# EAGLE design Mini_PLC_USB (EAGLE 9.6.2)

## Sheet 1 of 3
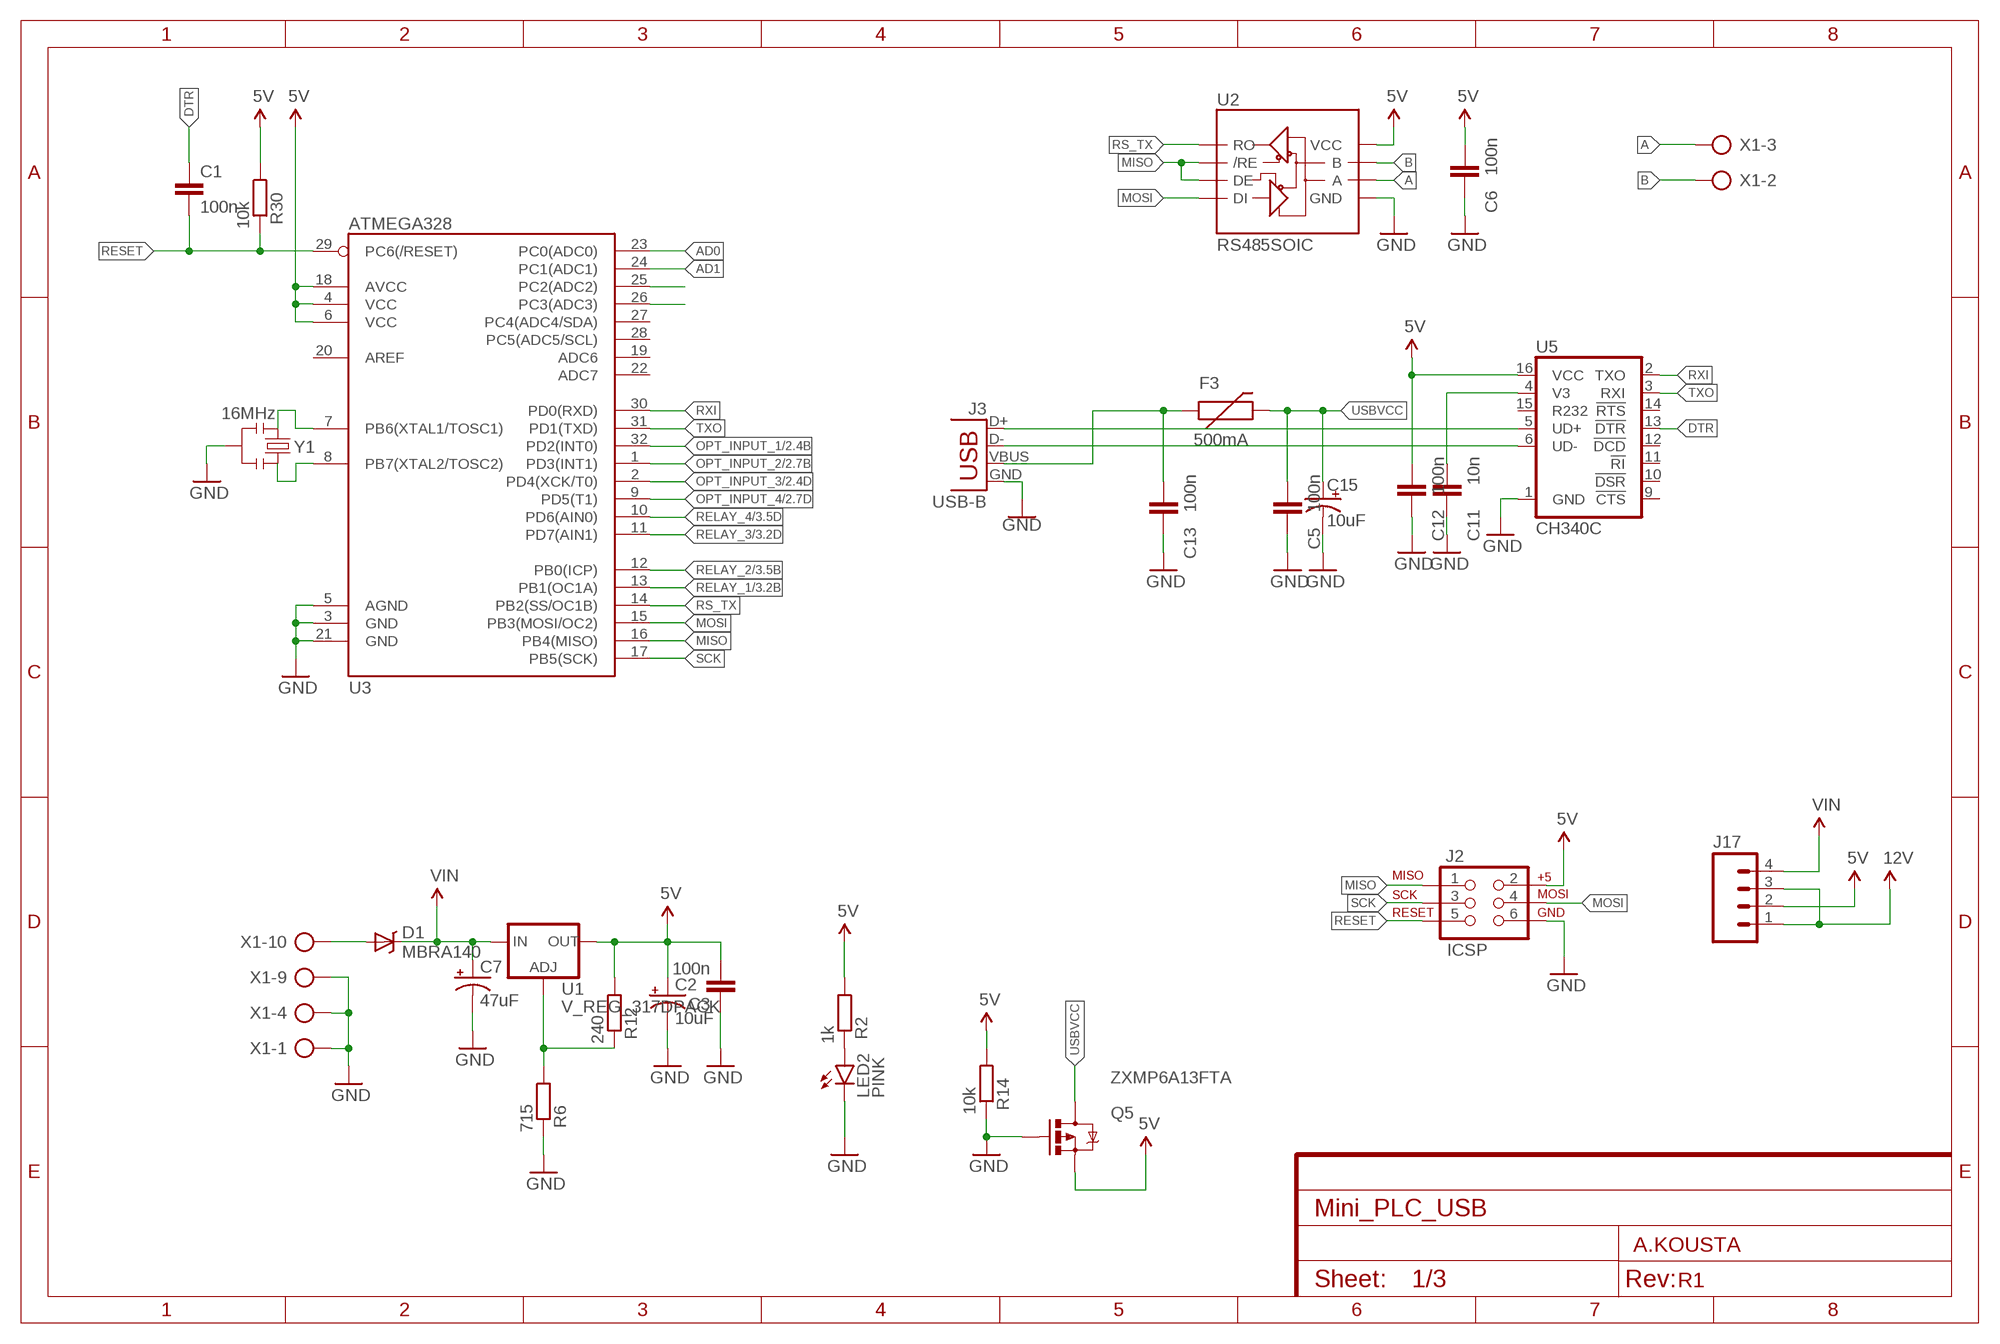
[diagram p0: schematic, sheet 1]

### Parts
C1  100n  C-EUC1206  [C1206]
C2  10uF  CAP_POL1206  [EIA3216]
C3  100n  C-EUC1206  [C1206]
C5  100n  C-EUC1206  [C1206]
C6  100n  C-EUC1206  [C1206]
C7  47uF  CAP_POLD  [PANASONIC_D]
C11  10n  C-EUC1206  [C1206]
C12  100n  C-EUC1206  [C1206]
C13  100n  C-EUC1206  [C1206]
C15  10uF  10UF-POLAR-EIA3216-16V-10%(TANT)  [EIA3216]
D1  MBRA140  DIODE-SCHOTTKY_  [SMA-DIODE]
F3  500mA  PTCSMD  [PTC-1206]
J2  ICSP  AVR_SPI_PRG_6PTH  [2X3]
J3  USB-B  USBPTH  [USB-B-PTH]
J17  M04PTH  [1X04]
LED2  PINK  LED-PINK1206  [LED-1206@1]
Q5  ZXMP6A13FTA  MOSFET-PCHANNELSMD  [SOT23-3]
R2  1k  R-EU_M1206  [M1206]
R6  715  R-EU_M1206  [M1206]
R12  240  R-EU_M1206  [M1206]
R14  10k  R-EU_M1206  [M1206]
R30  10k  R-EU_M1206  [M1206]
U1  V_REG_317DPACK  [V-REG_DPACK]
U2  RS485SOIC  [SO08]
U3  ATMEGA328  ATMEGA168  [TQFP32-08]
U5  CH340C  [SO016]
X1  AK500/10-H  [AK500/10-H]
Y1  16MHz  RESONATORSMD  [RESONATOR-SMD]

### Nets
5V: C2.A(+) C3.2 C6.2 C12.2 J2.2 J17.2 Q5.2(S) R2.1 R12.1 R14.1 R30.1 U1.4(OUT) U2.8(VCC) U3.4(VCC) U3.6(VCC) U3.18(AVCC) U5.16(VCC) ; also sheet 2
12V: J17.1 J17.3 ; also sheet 3
A: U2.6(A) X1.3
AD0: U3.23(PC0(ADC0))
AD1: U3.24(PC1(ADC1))
B: U2.7(B) X1.2
D+: J3.D+ U5.5(UD+)
D-: J3.D- U5.6(UD-)
DTR: C1.1 U5.13(!DTR)
GND: C2.C(-) C3.1 C5.1 C6.1 C7.- C11.1 C12.1 C13.1 C15.- J2.6 J3.GND LED2.C Q5.1(G) R6.2 R14.2 U2.5(GND) U3.3(GND) U3.5(AGND) U3.21(GND) U5.1(GND) X1.1 X1.4 X1.9 Y1.2 ; also sheet 2,3
MISO: J2.1 U2.2(/RE) U2.3(DE) U3.16(PB4(MISO))
MOSI: J2.4 U2.4(DI) U3.15(PB3(MOSI/OC2))
N$2: U3.25(PC2(ADC2))
N$3: LED2.A R2.2
N$7: U3.7(PB6(XTAL1/TOSC1)) Y1.1
N$8: R6.1 R12.2 U1.1(ADJ)
N$9: U3.26(PC3(ADC3))
N$12: U3.8(PB7(XTAL2/TOSC2)) Y1.3
N$14: D1.A X1.10
N$32: C11.2 U5.4(V3)
OPT_INPUT_1: U3.32(PD2(INT0)) ; also sheet 2
OPT_INPUT_2: U3.1(PD3(INT1)) ; also sheet 2
OPT_INPUT_3: U3.2(PD4(XCK/T0)) ; also sheet 2
OPT_INPUT_4: U3.9(PD5(T1)) ; also sheet 2
RELAY_1: U3.13(PB1(OC1A)) ; also sheet 3
RELAY_2: U3.12(PB0(ICP)) ; also sheet 3
RELAY_3: U3.11(PD7(AIN1)) ; also sheet 3
RELAY_4: U3.10(PD6(AIN0)) ; also sheet 3
RESET: C1.2 J2.5 R30.2 U3.29(PC6(/RESET))
RS_TX: U2.1(RO) U3.14(PB2(SS/OC1B))
RXI: U3.30(PD0(RXD)) U5.2(TXO)
SCK: J2.3 U3.17(PB5(SCK))
TXO: U3.31(PD1(TXD)) U5.3(RXI)
USBVCC: C5.2 C15.+ F3.2 Q5.3(D)
VIN: C7.+ D1.C J17.4 U1.3(IN) ; also sheet 2
VUSB [power]: C13.2 F3.1 J3.VBUS
Unconnected: U3.19(ADC6) U3.20(AREF) U3.22(ADC7) U3.27(PC4(ADC4/SDA)) U3.28(PC5(ADC5/SCL)) U5.9(!CTS) U5.10(!DSR) U5.11(!RI) U5.12(!DCD) U5.14(!RTS) U5.15(R232)

### Notes on the sheet
- A.KOUSTA
- R1

## Sheet 2 of 3
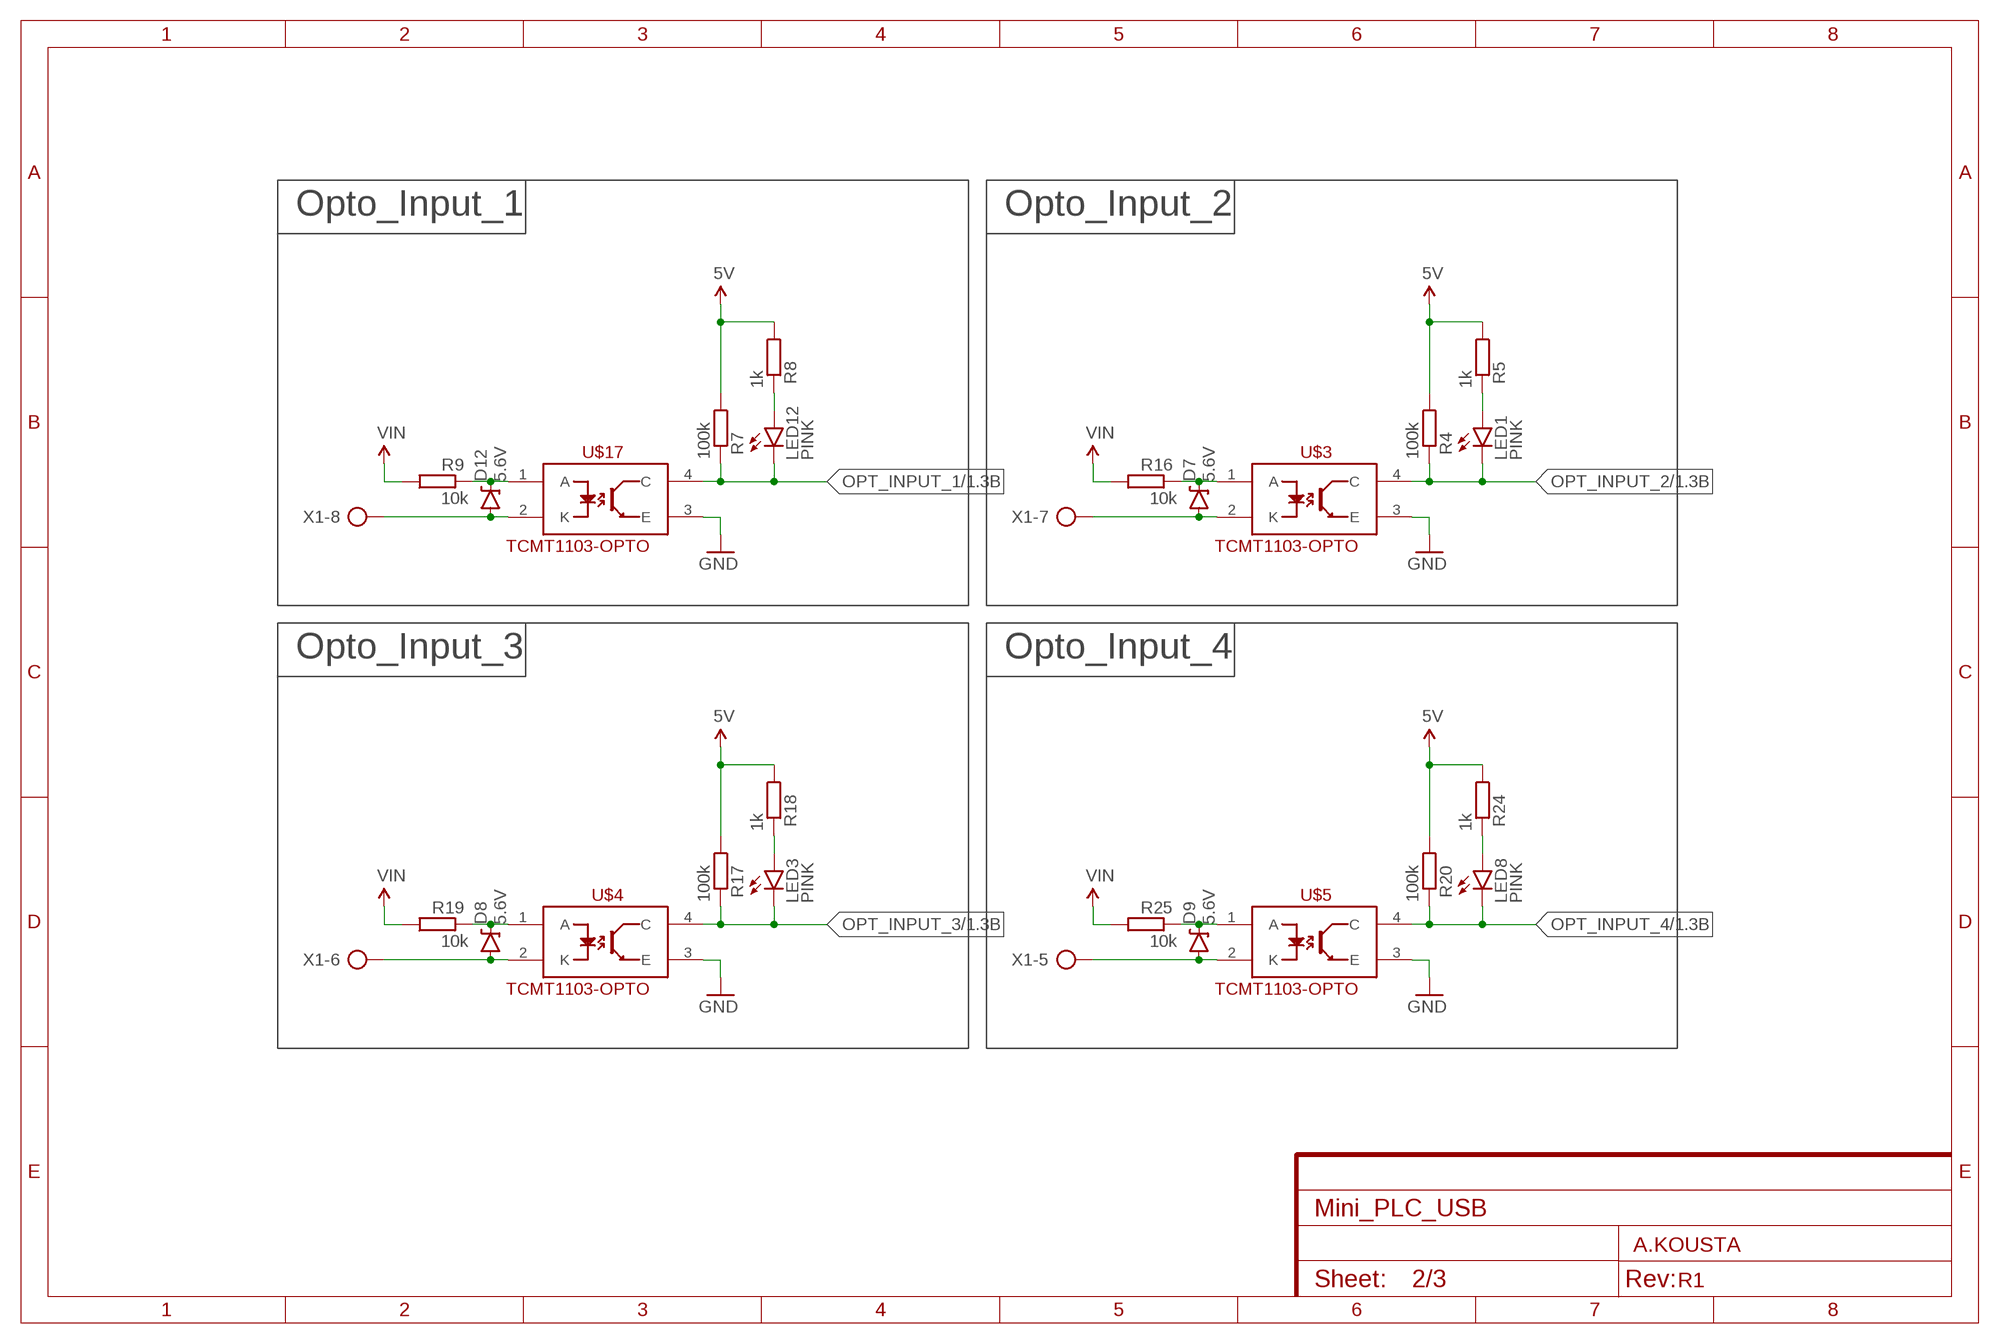
[diagram p1: schematic, sheet 2]

### Parts
D7  5.6V  DIODE-ZENER5.6V  [SOD-323]
D8  5.6V  DIODE-ZENER5.6V  [SOD-323]
D9  5.6V  DIODE-ZENER5.6V  [SOD-323]
D12  5.6V  DIODE-ZENER5.6V  [SOD-323]
LED1  PINK  LED-PINK1206  [LED-1206@1]
LED3  PINK  LED-PINK1206  [LED-1206@1]
LED8  PINK  LED-PINK1206  [LED-1206@1]
LED12  PINK  LED-PINK1206  [LED-1206@1]
R4  100k  R-EU_M1206  [M1206]
R5  1k  R-EU_M1206  [M1206]
R7  100k  R-EU_M1206  [M1206]
R8  1k  R-EU_M1206  [M1206]
R9  10k  R-EU_M1206  [M1206]
R16  10k  R-EU_M1206  [M1206]
R17  100k  R-EU_M1206  [M1206]
R18  1k  R-EU_M1206  [M1206]
R19  10k  R-EU_M1206  [M1206]
R20  100k  R-EU_M1206  [M1206]
R24  1k  R-EU_M1206  [M1206]
R25  10k  R-EU_M1206  [M1206]
U$3  TCMT1103-OPTO  [SSOP-4]
U$4  TCMT1103-OPTO  [SSOP-4]
U$5  TCMT1103-OPTO  [SSOP-4]
U$17  TCMT1103-OPTO  [SSOP-4]

### Nets
5V: R4.1 R5.1 R7.1 R8.1 R17.1 R18.1 R20.1 R24.1 ; also sheet 1
GND: U$3.3(E) U$4.3(E) U$5.3(E) U$17.3(E) ; also sheet 1,3
N$1: D12.A U$17.2(K) X1.8
N$5: D12.C R9.2 U$17.1(A)
N$6: D7.C R16.2 U$3.1(A)
N$13: D7.A U$3.2(K) X1.7
N$17: LED1.A R5.2
N$19: D8.C R19.2 U$4.1(A)
N$20: D8.A U$4.2(K) X1.6
N$23: LED3.A R18.2
N$26: D9.C R25.2 U$5.1(A)
N$27: D9.A U$5.2(K) X1.5
N$31: LED8.A R24.2
N$33: LED12.A R8.2
OPT_INPUT_1: LED12.C R7.2 U$17.4(C) ; also sheet 1
OPT_INPUT_2: LED1.C R4.2 U$3.4(C) ; also sheet 1
OPT_INPUT_3: LED3.C R17.2 U$4.4(C) ; also sheet 1
OPT_INPUT_4: LED8.C R20.2 U$5.4(C) ; also sheet 1
VIN: R9.1 R16.1 R19.1 R25.1 ; also sheet 1

### Notes on the sheet
- Opto_Input_1 | Opto_Input_2
- Opto_Input_3 | Opto_Input_4
- A.KOUSTA
- R1

## Sheet 3 of 3
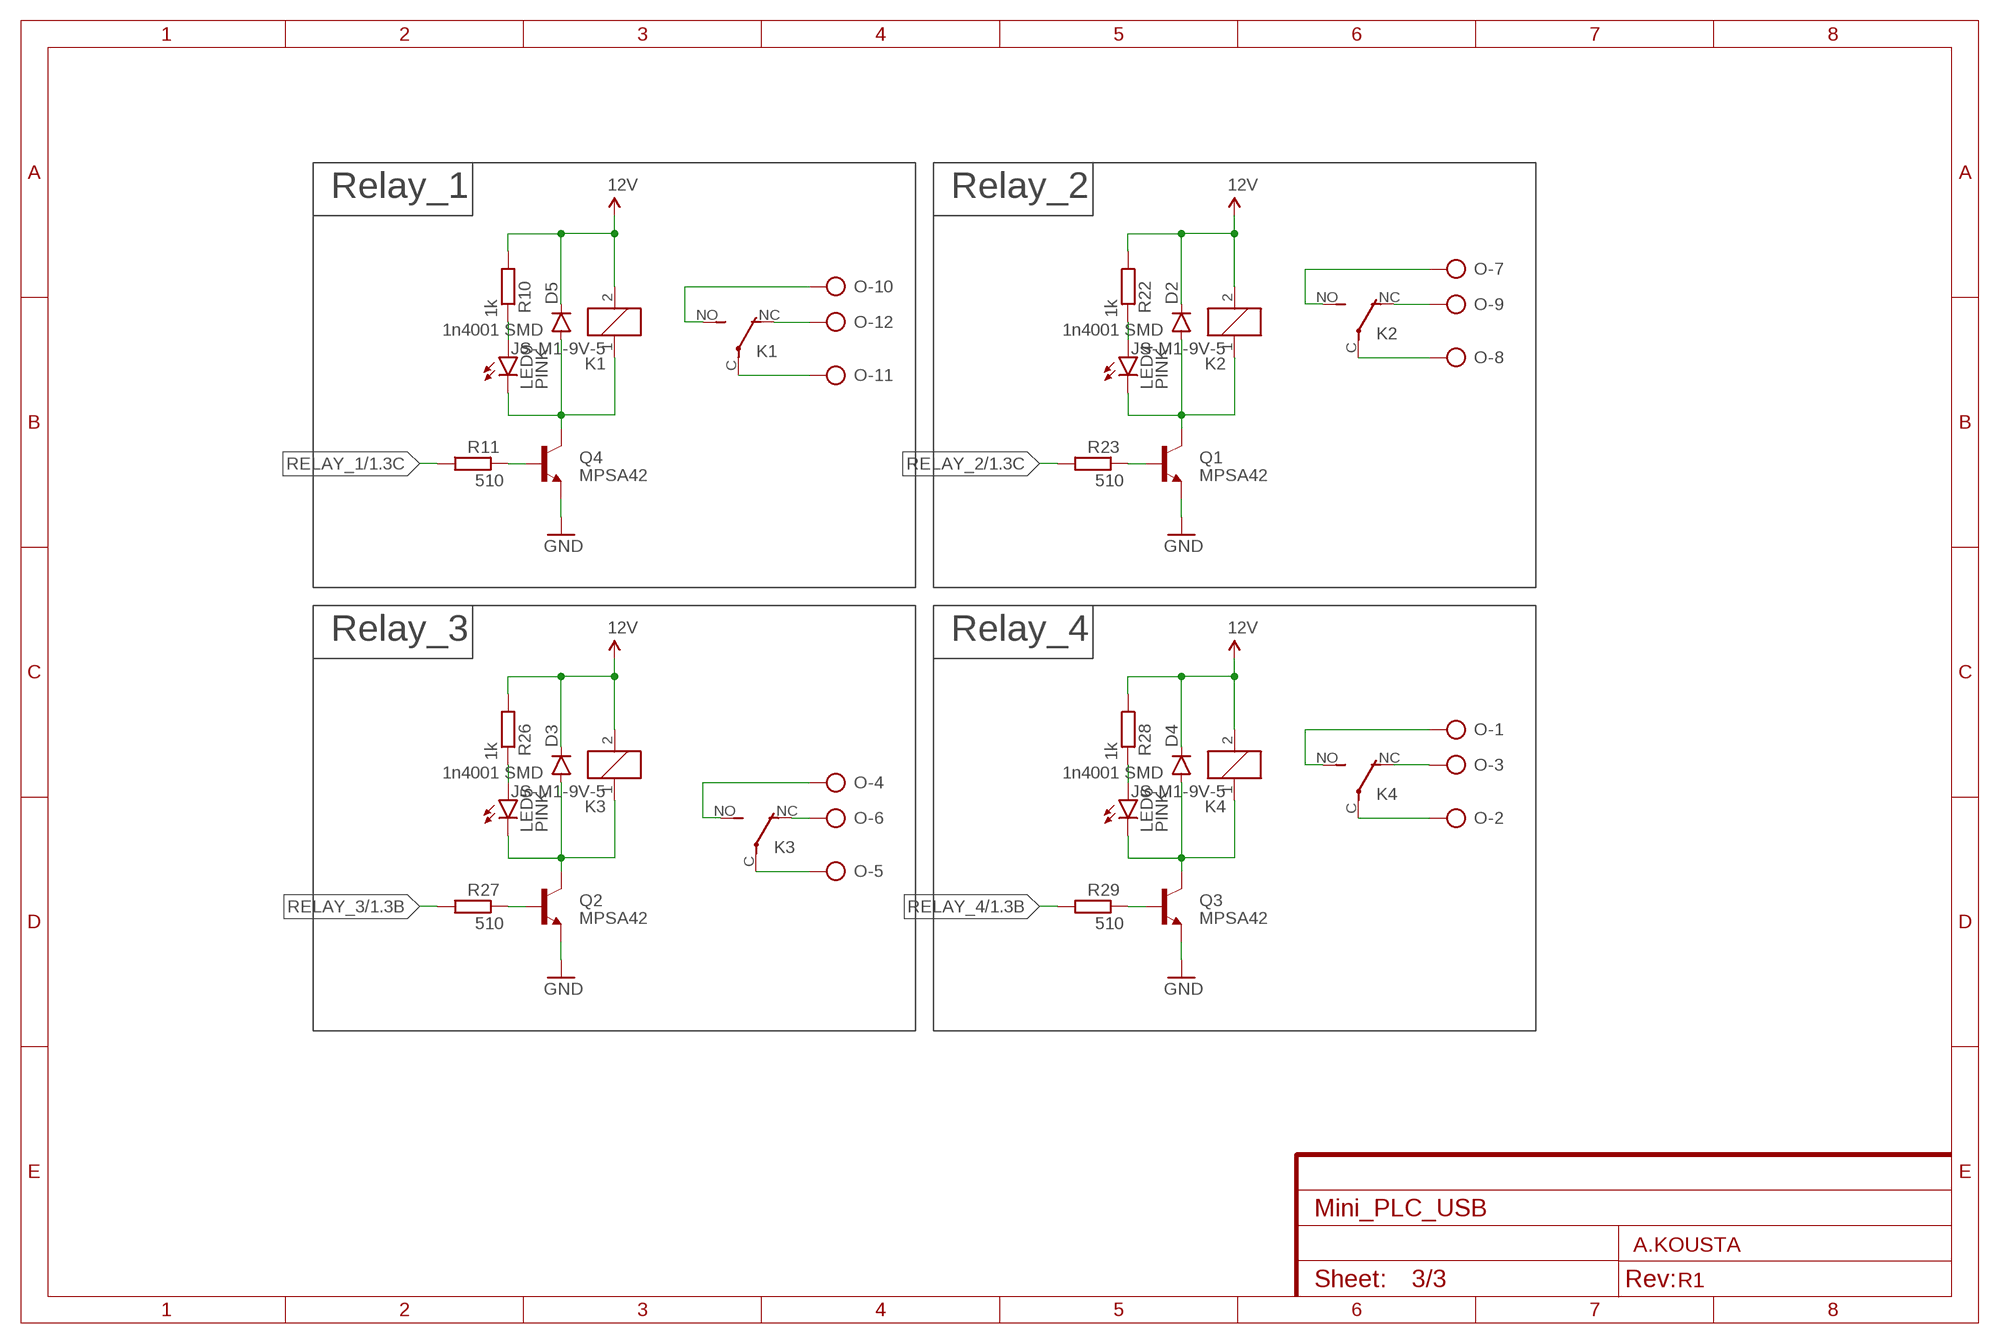
[diagram p2: schematic, sheet 3]

### Parts
D2  1n4001 SMD  DIODESOD123  [SOD-123]
D3  1n4001 SMD  DIODESOD123  [SOD-123]
D4  1n4001 SMD  DIODESOD123  [SOD-123]
D5  1n4001 SMD  DIODESOD123  [SOD-123]
K1  JS-M1-9V-5  [JS-M]
K2  JS-M1-9V-5  [JS-M]
K3  JS-M1-9V-5  [JS-M]
K4  JS-M1-9V-5  [JS-M]
LED4  PINK  LED-PINK1206  [LED-1206@1]
LED5  PINK  LED-PINK1206  [LED-1206@1]
LED6  PINK  LED-PINK1206  [LED-1206@1]
LED9  PINK  LED-PINK1206  [LED-1206@1]
O  AK500/12-H  [AK500/12-H]
Q1  MPSA42  TRANSISTOR_NPNMPSA42  [SOT23-3@1]
Q2  MPSA42  TRANSISTOR_NPNMPSA42  [SOT23-3@1]
Q3  MPSA42  TRANSISTOR_NPNMPSA42  [SOT23-3@1]
Q4  MPSA42  TRANSISTOR_NPNMPSA42  [SOT23-3@1]
R10  1k  R-EU_M1206  [M1206]
R11  510  R-EU_M1206  [M1206]
R22  1k  R-EU_M1206  [M1206]
R23  510  R-EU_M1206  [M1206]
R26  1k  R-EU_M1206  [M1206]
R27  510  R-EU_M1206  [M1206]
R28  1k  R-EU_M1206  [M1206]
R29  510  R-EU_M1206  [M1206]

### Nets
12V: D2.C D3.C D4.C D5.C K1.2 K2.2 K3.2 K4.2 R10.1 R22.1 R26.1 R28.1 ; also sheet 1
GND: Q1.2(E) Q2.2(E) Q3.2(E) Q4.2(E) ; also sheet 1,2
N$11: D2.A K2.1 LED4.C Q1.3(C)
N$15: Q1.1(B) R23.2
N$18: LED4.A R22.2
N$28: D5.A K1.1 LED9.C Q4.3(C)
N$30: LED9.A R10.2
N$37: D3.A K3.1 LED5.C Q2.3(C)
N$39: Q4.1(B) R11.2
N$41: Q2.1(B) R27.2
N$43: LED5.A R26.2
N$46: K1.C(2:P) O.11
N$48: K1.NC(2:O) O.12
N$49: K1.NO(2:S) O.10
N$50: D4.A K4.1 LED6.C Q3.3(C)
N$51: Q3.1(B) R29.2
N$52: K2.C(2:P) O.8
N$53: K2.NC(2:O) O.9
N$54: K2.NO(2:S) O.7
N$56: LED6.A R28.2
N$57: K3.C(2:P) O.5
N$58: K3.NC(2:O) O.6
N$59: K3.NO(2:S) O.4
N$62: K4.C(2:P) O.2
N$63: K4.NC(2:O) O.3
N$64: K4.NO(2:S) O.1
RELAY_1: R11.1 ; also sheet 1
RELAY_2: R23.1 ; also sheet 1
RELAY_3: R27.1 ; also sheet 1
RELAY_4: R29.1 ; also sheet 1

### Notes on the sheet
- Relay_1 | Relay_2
- Relay_3 | Relay_4
- A.KOUSTA
- R1

## Library data of the parts
C1 C3 C5 C6 C11-C13 = rcl:C-EU: CAPACITOR, European symbol
C2 = SparkFun:CAP_POL: Capacitor Polarized These are standard SMD and PTH capacitors. Normally 10uF, 47uF, and 100uF in electrolytic and tantalum varieties. Always verify the external diameter of the through hole cap, it varies with capacity, voltage, and manufacturer. The EIA devices should be standard.; OC_FARNELL: unknown
C7 = SparkFun:CAP_POL: Capacitor Polarized These are standard SMD and PTH capacitors. Normally 10uF, 47uF, and 100uF in electrolytic and tantalum varieties. Always verify the external diameter of the through hole cap, it varies with capacity, voltage, and manufacturer. The EIA devices should be standard.; MF: PANASONIC ELECTRONIC COMPONENTS; MPN: EEE1CA470SP; OC_FARNELL: 9696946
C15 = SparkFun-Capacitors:10UF-POLAR: 10.0µF polarized capacitors A capacitor is a passive two-terminal electrical component used to store electrical energy temporarily in an electric field.; PROD_ID: CAP-00811
D1 = SparkFun:DIODE-SCHOTTKY; MF: DIODES INC.; MPN: B140-13-F; OC_FARNELL: 1843670
D2-D5 = SparkFun-DiscreteSemi:DIODE: Diode These are standard reverse protection diodes and small signal diodes. SMA package can handle up to about 1A. SOD-323 can handle about 200mA. What the SOD-323 package when ordering, there are some mfgs out there that are 5-pin packages.; OC_FARNELL: unknown; OC_NEWARK: unknown
D7-D9 D12 = SparkFun-DiscreteSemi:DIODE-ZENER: Zener Diode Production Part - 8199 3.4V Zener Voltage; PROD_ID: DIO-12442
F3 = SparkFun:PTC: Resettable Fuse PTC Resettable Fuse. Spark Fun Electronics SKU : COM-08357; OC_FARNELL: 1700871; OC_NEWARK: unknown
J2 = SparkFun-Connectors:AVR_SPI_PRG_6: AVR ISP 6 Pin This is the reduced ISP connector for AVR programming. Common on Arduino. This footprint will take up less PCB space and can be used with a 10-pin to 6-pin adapter such as SKU: BOB-08508 **Special note about "TEST_POINT" package. The stop mask is on the top side, so if you want your programming test points to be on the bottom of your board, make sure to place this package on the bottom side of the board. This also ensure that the orientation to program from the bottom side will be correct.; OC_FARNELL: unknown
J3 = SparkFun-Connectors:USB: USB Connectors USB-B-PTH is fully proven SKU : PRT-00139/CONN-08278 USB-miniB is fully proven SKU : PRT-00587 USB-A-PCB is untested. USB-A-H is throughly reviewed, but untested. Spark Fun Electronics SKU : PRT-00437 USB-B-SMT is throughly reviewed, but untested. Needs silkscreen touching up. USB-A-S has not been used/tested USB-MB-H has not been used/tested USB-MICROB has been used. CONN-09505; MPN: USB-B-S-RA; OC_NEWARK: 14N8154; PROD_ID: CONN-08278
J17 = SparkFun-Connectors:M04: Header 4 Standard 4-pin 0.1" header. Use with straight break away headers (SKU : PRT-00116), right angle break away headers (PRT-00553), swiss pins (PRT-00743), machine pins (PRT-00117), and female headers (PRT-00115). Molex polarized connector foot print use with SKU : PRT-08231 with associated crimp pins and housings. 1MM SMD Version SKU: PRT-10208; OC_FARNELL: unknown; PROD_ID: CONN-09696
K1-K4 = relay:JS-M1*: Automotive Ultra-Miniature Power Relay NAiS Source: http://www.mew-europe.com/.. en_ds_61211_0000.pdf; OC_FARNELL: unknown; OC_NEWARK: unknown
LED1-LED6 LED8 LED9 LED12 = SparkFun-LED:LED-PINK: Various Pink LEDs Pink LEDs used in SFE Production LILYPAD- DIO-10415; OC_FARNELL: unknown; PROD_ID: DIO-10415
O = con-ptr500:AK500/12-H: CONNECTOR Aug. 2004 / PTR Meßtechnik: Die Bezeichnung der Serie AK505 wurde geändert. Es handelt sich hierbei um AK500 in horizontaler Ausführung.; OC_FARNELL: unknown; OC_NEWARK: unknown
Q1-Q4 = SparkFun-DiscreteSemi:TRANSISTOR_NPN: Generic NPN BJT MMBT2222A - TRANS-08049 (SOT-23, 1A 40V) MPSA42 - TRANS-09116 (SOT-23, 500mA 300V) MMBT5088LT1G - TRANS-11160 (SOT-23, 50 mA 30V) BC547 - COM-08928 (TO-92 45V 100mA) (1.Collector 2.Base 3.Emitter) 2N3904 - COM-00521 (TO-92 40V 200mA) (1.Emitter 2.Base 3.Collector) P2N2222A - COM-12852 (TO-92 40V 600mA) (1.Collector 2.Base 3.Emitter); OC_FARNELL: unknown; OC_NEWARK: unknown; PROD_ID: TRANS-09116
Q5 = SparkFun:MOSFET-PCHANNEL; MPN: ZXMP6A13FTA; OC_FARNELL: 1843770RL; OC_NEWARK: 12T2278
R2 R4-R12 R14 R16-R20 R22-R30 = rcl:R-EU_: RESISTOR, European symbol
U1 = SparkFun-PowerIC:V_REG_317: Voltage Regulator Standard LM317 adjustable voltage regulator. AOI (Adjust Output Input). Google 'LM317 Calculator' for easy to use app to get the two resistor values needed. 240/720 for 5V output. 240/390 for 3.3V output. Spark Fun Electronics SKU : COM-00527; OC_FARNELL: unknown; PROD_ID: IC-09888
U2 = SparkFun:RS485
U3 = SparkFun:ATMEGA168; OC_FARNELL: unknown
U5 = SparkFun-IC-Comms:CH340C; PROD_ID: IC-14038
U$3-U$5 U$17 = SparkFun-DiscreteSemi:TCMT1103-OPTO: Optoisolator- NPN output; OC_FARNELL: unknown
X1 = con-ptr500:AK500/10-H: CONNECTOR Aug. 2004 / PTR Meßtechnik: Die Bezeichnung der Serie AK505 wurde geändert. Es handelt sich hierbei um AK500 in horizontaler Ausführung.; OC_FARNELL: unknown; OC_NEWARK: unknown
Y1 = SparkFun-FreqCtrl:RESONATOR: Resonator Small SMD resonator. This is the itty bitty 10/20MHz resonators with built in caps. CSTCE10M0G55 and CSTCE20M0V53. Footprint has been reviewed closely but hasn't been tested yet.; OC_FARNELL: unknown

## Net classes
0 default: width 0.152 mm, drill 0.305 mm, clearance 0.152 mm
1 power: width 0.254 mm

## Board
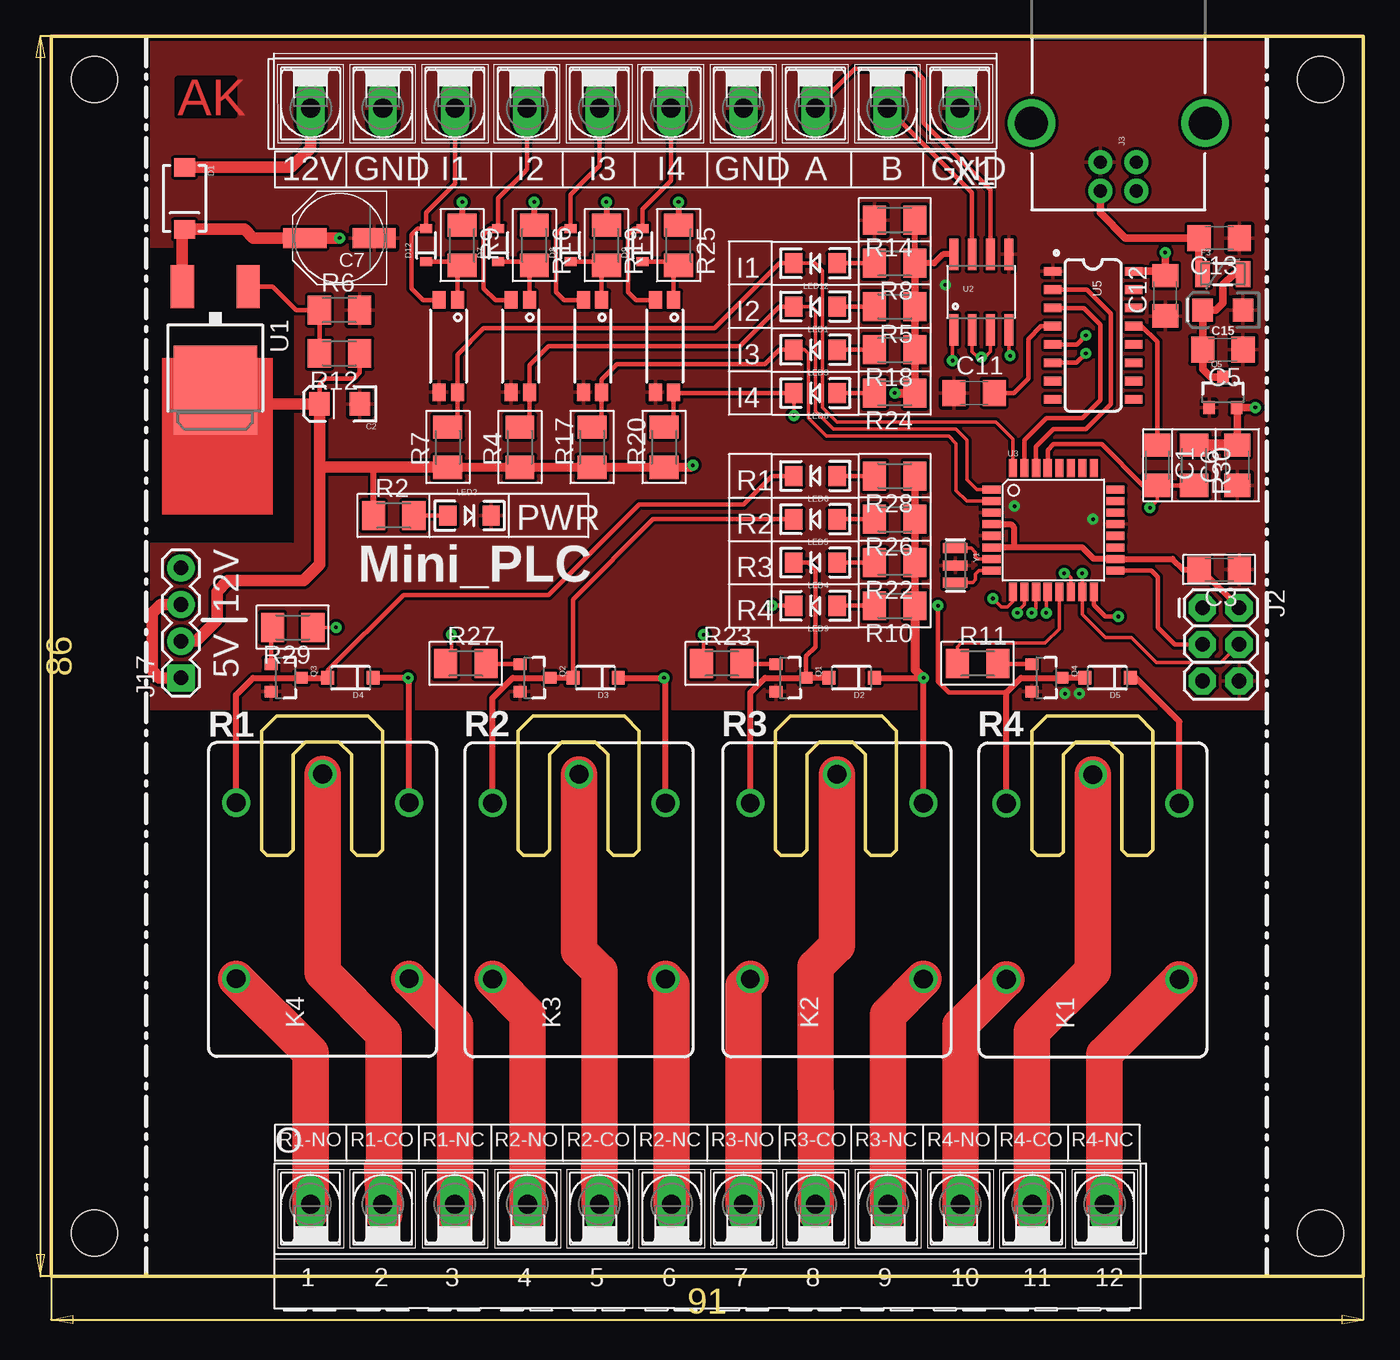
[diagram p3: board, top side]
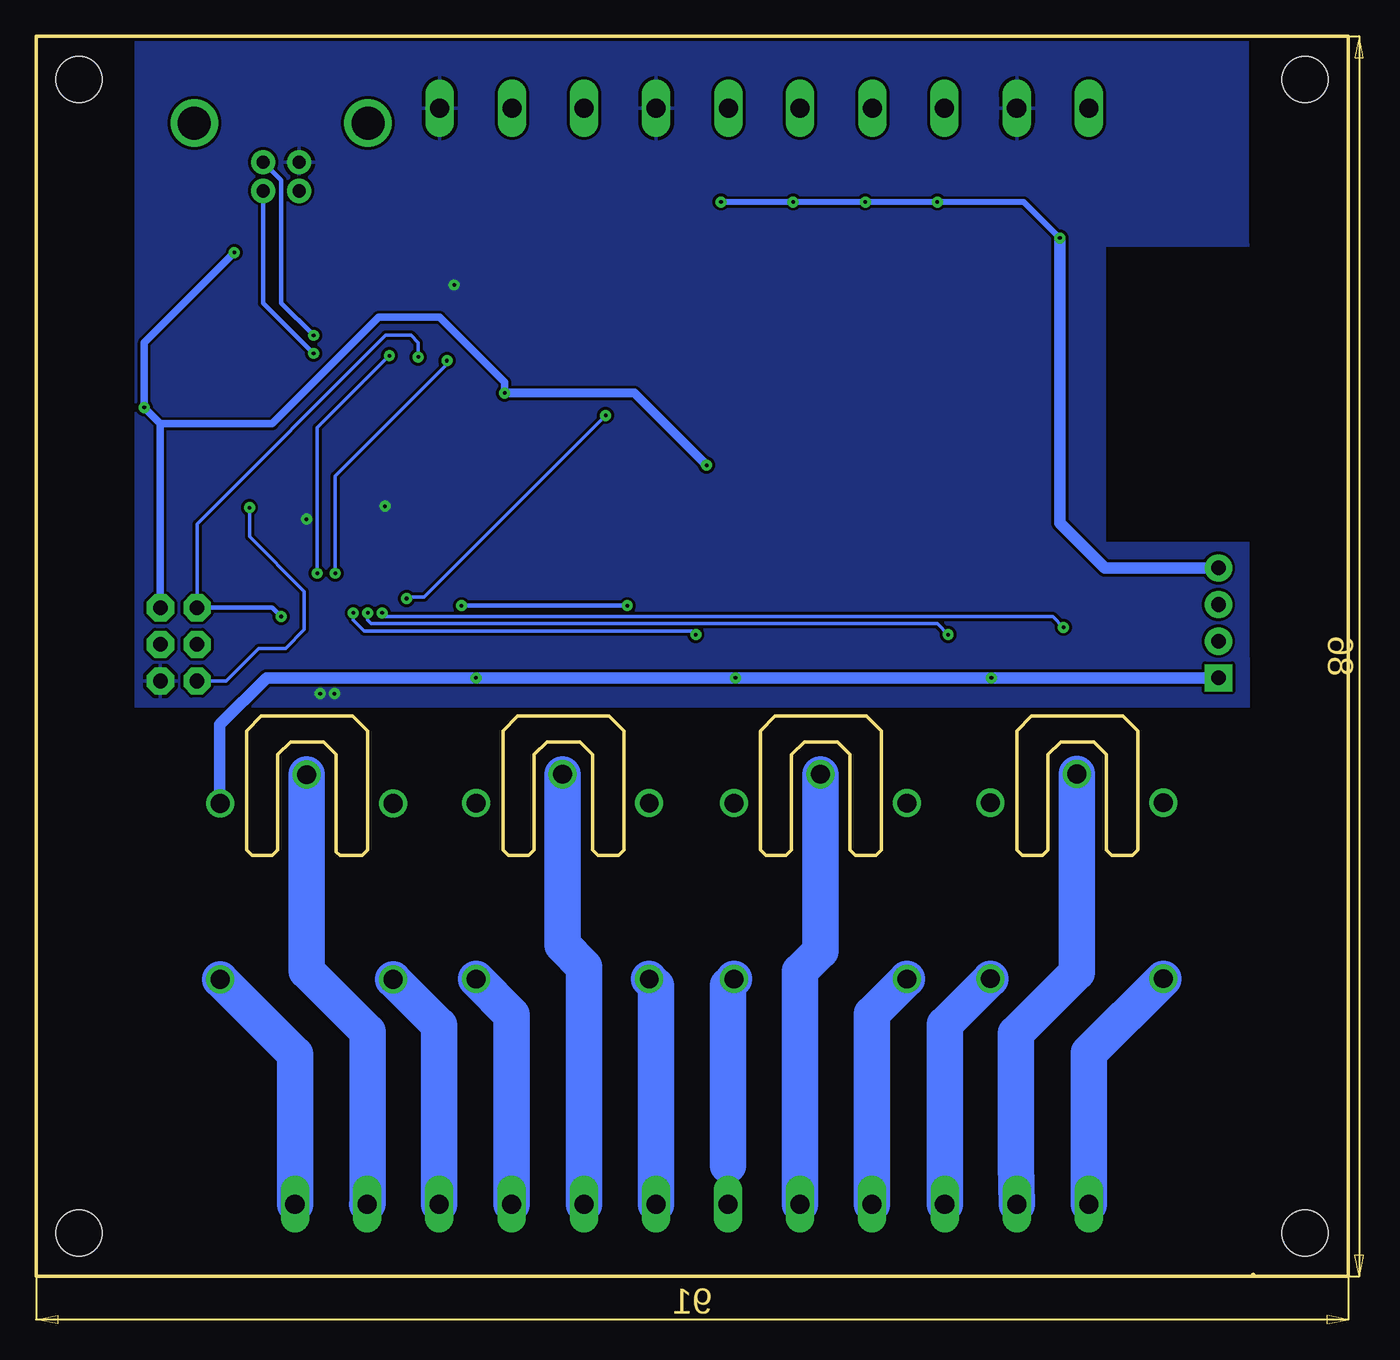
[diagram p4: board, bottom side, seen from below]

Size 91 x 86 mm. Coordinates in mm from the lower left corner, seen from the top.
Outline: 70 segments
Copper layers (1*16): Top 0.035mm / dielectric 1.5mm / Bottom 0.035mm
Design rules "SparkFun": minimum track width 8mil, minimum drill 20mil, track to track 8mil, track to pad 8mil, pad to pad 8mil, via to via 8mil, smd to smd 8mil, copper to edge 8mil, drill to drill 8mil, minimum pad ring 12mil, minimum via ring 10mil, stop-mask expansion 4mil, vias tented up to drill 20mil, thermal gap 10mil
Holes 3.2 mm at 88.01,82.98 88.01,3 3,3 3,82.98
tKeepout: area 7.7,52.9 to 15.4,63.5
tRestrict: area 0.2,-2.7 to 90.3,39.2; area 6.3,50.9 to 16.8,71.3
bRestrict: area 0.2,-2 to 91.3,39.4; area 6.2,51 to 16.8,71.4

### Footprints (pad centres in the part's own frame; a part is rotated, then mirrored left to right if it is on the bottom)
C1206 = smd 1.6 x 1.8: 1 -1.4,0; 2 1.4,0
EIA3216 = smd 1.4 x 1.6: A 1.4,0; C -1.4,0
PANASONIC_D = smd 3 x 1.4: + 2.4,0; - -2.4,0
EIA3216' = smd 1.4 x 1.6: + 1.4,0; - -1.4,0
SMA-DIODE = smd 1.27 x 1.47: A -2.15,0; C 2.15,0
SOD-123 = smd 0.9 x 0.95: A 1.575,0; C -1.575,0
SOD-323 = smd 0.63 x 0.83: A 1.15,0; C -1.15,0
PTC-1206 = smd 1 x 1.8: 1 -1.4,0; 2 1.4,0
2X3 = drill 1.016 pad 1.88 octagon: 1 0,0; 2 0,2.54; 3 2.54,0; 4 2.54,2.54; 5 5.08,0; 6 5.08,2.54
USB-B-PTH = drill 0.914 pad 1.676: D+ 0,1.25; D- 1.981,1.25; GND 0,-1.25; VBUS 1.981,-1.25 | drill 2.286: S1 -2.718,-6.02; S2 -2.718,6.02
1X04 = drill 1.016 pad 1.88 square: 1 0,0 | drill 1.016 pad 1.88: 2 2.54,0; 3 5.08,0; 4 7.62,0
JS-M = drill 1.3: 1 6.7,6; 2 6.7,-6; C 8.7,0; NC -5.5,-6; NO -5.5,6
LED-1206@1 = smd 1.2 x 1.4: A -1.5,0; C 1.5,0
AK500/12-H = drill 1.321 long: 1 -27.534,0; 2 -22.53,0; 3 -17.526,0; 4 -12.497,0; 5 -7.493,0; 6 -2.489,0; 7 2.489,0; 8 7.493,0; 9 12.497,0; 10 17.526,0; 11 22.53,0; 12 27.534,0
SOT23-3@1 = smd 0.8 x 0.9: 1 -0.95,-1; 2 0.95,-1; 3 0,1.1
SOT23-3 = smd 0.8 x 0.9: 1 -0.95,-1; 2 0.95,-1; 3 0,1.1
M1206 = smd 1.6 x 2: 1 -1.4,0; 2 1.4,0
V-REG_DPACK = smd 1.6 x 3: 1 -2.28,-4.8; 3 2.28,-4.8 | smd 5.8 x 6.2: 4 0,2.38
SO08 = smd 0.61 x 2.21: 1 -1.905,-2.616; 2 -0.635,-2.616; 3 0.635,-2.616; 4 1.905,-2.616; 5 1.905,2.616; 6 0.635,2.616; 7 -0.635,2.616; 8 -1.905,2.616
TQFP32-08 = smd 1.27 x 0.559: 1 -4.293,2.8; 2 -4.293,2; 3 -4.293,1.2; 4 -4.293,0.4; 5 -4.293,-0.4; 6 -4.293,-1.2; 7 -4.293,-2; 8 -4.293,-2.8; 17 4.293,-2.8; 18 4.293,-2; 19 4.293,-1.2; 20 4.293,-0.4; 21 4.293,0.4; 22 4.293,1.2; 23 4.293,2; 24 4.293,2.8 | smd 0.559 x 1.27: 9 -2.8,-4.293; 10 -2,-4.293; 11 -1.2,-4.293; 12 -0.4,-4.293; 13 0.4,-4.293; 14 1.2,-4.293; 15 2,-4.293; 16 2.8,-4.293; 25 2.8,4.293; 26 2,4.293; 27 1.2,4.293; 28 0.4,4.293; 29 -0.4,4.293; 30 -1.2,4.293; 31 -2,4.293; 32 -2.8,4.293
SO016 = smd 0.6 x 1.2: 1 -4.445,-2.8; 2 -3.175,-2.8; 3 -1.905,-2.8; 4 -0.635,-2.8; 5 0.635,-2.8; 6 1.905,-2.8; 7 3.175,-2.8; 8 4.445,-2.8; 9 4.445,2.8; 10 3.175,2.8; 11 1.905,2.8; 12 0.635,2.8; 13 -0.635,2.8; 14 -1.905,2.8; 15 -3.175,2.8; 16 -4.445,2.8
SSOP-4 = smd 1.2 x 0.9: 1 -3.2,0.67; 2 -3.2,-0.6; 3 3.2,-0.6; 4 3.2,0.67
AK500/10-H = drill 1.321 long: 1 -22.504,0; 2 -17.501,0; 3 -12.497,0; 4 -7.493,0; 5 -2.489,0; 6 2.489,0; 7 7.493,0; 8 12.497,0; 9 17.501,0; 10 22.504,0
RESONATOR-SMD = smd 0.7 x 1.7: 1 -1.2,0; 2 0,0; 3 1.2,0

### Placement (x,y rotation side)
C1  76.7,56.25 270 top
C2  20,60.5 180 top
C3  81,49 180 top
C5  81.25,64.25 180 top
C6  82.25,56.25 90 top
C7  20,72 180 top
C11  64,61.25 0 top
C12  77.25,68 90 top
C13  81,72 180 top
C15  10uF  [EIA3216']  81.25,67 180 top
D1  9.25,74.75 270 top
D2  55.5,41.5 180 top
D3  37.75,41.5 180 top
D4  20.75,41.5 180 top
D5  73.25,41.5 180 top
D7  31,71.5 90 top
D8  36,71.5 90 top
D9  41,71.5 90 top
D12  26,71.5 90 top
F3  81.25,69.5 0 top
J2  79.84,46.36 270 top
J3  74,77.25 270 top
J17  9,41.5 90 top
K1  72.24,26.09 90 top
K2  54.48,26.11 90 top
K3  36.6,26.11 90 top
K4  18.82,26.14 90 top
LED1  53,67.25 180 top
LED2  29,52.75 0 top
LED3  53,64.25 180 top
LED4  53,49.5 180 top
LED5  53,52.5 180 top
LED6  53,55.5 180 top
LED8  53,61.25 180 top
LED9  53,46.5 180 top
LED12  53,70.25 180 top
O  45.52,5.01 0 top
Q1  51.25,41.5 270 top
Q2  33.5,41.5 270 top
Q3  16.25,41.5 270 top
Q4  69,41.5 270 top
Q5  81.25,61.25 0 top
R2  23.75,52.75 0 top
R4  32.5,57.5 90 top
R5  58.5,67.25 180 top
R6  20,67 0 top
R7  27.5,57.5 90 top
R8  58.5,70.25 180 top
R9  28.5,71.5 270 top
R10  58.5,46.5 180 top
R11  64.25,42.5 0 top
R12  20,64 180 top
R14  58.5,73.25 180 top
R16  33.5,71.5 270 top
R17  37.5,57.5 90 top
R18  58.5,64.25 180 top
R19  38.5,71.5 270 top
R20  42.5,57.5 90 top
R22  58.5,49.5 180 top
R23  46.5,42.5 0 top
R24  58.5,61.25 180 top
R25  43.5,71.5 270 top
R26  58.5,52.5 180 top
R27  28.75,42.5 0 top
R28  58.5,55.5 180 top
R29  16.75,45 180 top
R30  79.25,56.25 270 top
U1  11.38,63.83 180 top
U2  64.5,68.25 0 top
U3  69.5,51.75 0 top
U5  72.25,65.25 270 top
U$3  32.5,64.5 270 top
U$4  37.5,64.5 270 top
U$5  42.5,64.5 270 top
U$17  27.5,64.5 270 top
X1  40.5,81 180 top
Y1  62.7,49.3 270 top

### Tracks (layer width: path | path; a pad name or v marks a point on that pad's centre or on a via)
5V  (via drill 0.25)
  Top 0.305: R12.1 21.4,62.65 21,62.25 19,62.25 18.6,61.85 C2.A
  Top 0.406: J2.2 79.74,49 C3.2 78.5,49 77.75,49.75 U3.18 72.3,49.75 71.5,50.55 66.75,50.55 | 66.75,50.55 U3.6 | U3.4 66.55,52.15 66.75,51.95 66.75,50.55 | R2.1 22.35,55.95 22.5,56.1 | R14.1 R8.1 61.23,70.25 61.84,70.87 U2.8
  Top 0.508: R8.1 R5.1 R18.1 R24.1 | C6.2 82.25,60.2 Q5.2 v83.5,60.25 | U5.16 76.95,69.69 C12.2 v77.25,71
  Top 0.61: R7.1 27.75,56.1 R4.1 R17.1 R20.1 44.35,56.1 v44.5,56.25 | v58.5,61.25 R24.1
  Top 0.813: U1.4 12.33,60.5 C2.A 18.6,56.15 | 27.75,56.1 22.5,56.1 18.65,56.1 18.6,56.15 | J17.2 10.04,44.04 11.5,45.5 11.5,47.5 12.25,48.25 17.5,48.25 18.6,49.35 18.6,56.15 | C6.2 R30.1
  Bottom 0.508: 82.38,59.13 v83.5,60.25 83.5,64.75 v77.25,71 | J2.2 82.38,59.13 | 82.38,59.13 74.62,59.13 67.25,66.5 63,66.5 58.5,62 v58.5,61.25
  Bottom 0.61: v44.5,56.25 49.5,61.25 v58.5,61.25
12V  (via drill 0.25)
  Top 0.406: K4.2 24.82,41.43 v24.75,41.5 D4.C | K1.2 78.24,38.46 75.2,41.5 D5.C | K2.2 60.48,41.48 | 60.48,41.48 v60.5,41.5 | D2.C 60.47,41.5 60.48,41.48 | K3.2 42.6,41.4 v42.5,41.5 D3.C
  Top 0.508: R28.1 R26.1 R22.1 R10.1
  Top 0.61: R10.1 59.9,42.06 60.48,41.48
  Top 0.813: J17.3 7.58,46.58 7,46 7,42 7.5,41.5 J17.1
  Bottom 0.813: J17.1 v24.75,41.5 v42.5,41.5 v60.5,41.5 75,41.5 78.25,38.25 K1.2
A
  Top 0.305: U2.6 65.14,75.36 60.5,80 60.5,83 59.75,83.75 55.75,83.75 X1.3
B
  Top 0.305: U2.7 63.87,75.14 X1.2
D+  (via drill 0.25)
  Top 0.305: U5.5 71.11,64.61 v71.75,65.25
  Bottom 0.305: v71.75,65.25 74,67.5 74,76 J3.D+
D-  (via drill 0.25)
  Top 0.305: U5.6 71.09,63.34 v71.75,64
  Bottom 0.305: v71.75,64 75.25,67.5 J3.D-
DTR
  Top 0.305: C1.1 76.7,64.8 75.61,65.89 U5.13
GND  (via drill 0.25)
  other vias: 70.3,40.4 71.3,40.4 62,68.75 66.8,53.4 72.25,52.5
  pour Bottom: 6.91,-0.1 84.05,0.03 84.05,85.85 7.01,86.01
  pour Top: 6.98,86.01 6.98,0.03 84.1,0 84.07,85.9
MISO  (via drill 0.25)
  Top 0.254: U2.2 63.87,64.14 64.25,63.75 v64.5,63.75 64.75,63.75 65.14,64.14 U2.3
  Top 0.305: U3.16 72.3,46.55 73.1,45.75 v74,45.75
  Bottom 0.254: J2.1 79.84,52.16 66.75,65.25 65,65.25 64.5,64.75 v64.5,63.75
  Bottom 0.305: v74,45.75 74.61,46.36 J2.1
MOSI  (via drill 0.25)
  Top 0.254: J2.4 81.1,42.55 76.65,42.55 74.9,44.3 73.1,44.3 71.5,45.9 U3.15 v71.5,48.75 | v66.5,63.84 66.41,63.93 U2.4
  Top 0.305: J2.4
  Bottom 0.254: v71.5,48.75 71.5,58.84 v66.5,63.84
N$1
  Top 0.305: U$17.2 25.8,67.7 25,68.5 25,72.25 25.4,72.65 D12.A 26,73.75 28,75.75 X1.8
N$3
  Top 0.305: LED2.A R2.2
N$5
  Top 0.305: U$17.1 28.17,69.77 R9.2 28.25,70.35 D12.C
N$6
  Top 0.305: U$3.1 33.17,69.77 R16.2 33.25,70.35 D7.C
N$7
  Top 0.254: U3.7 64.25,49.75 64.1,49.9 64.1,50.2 63.8,50.5 Y1.1
N$8
  Top 0.305: U1.1 15.37,68.63 17,67 R6.1 R12.2
N$11
  Top 0.305: LED4.C 52.5,49.5 53,49 53,43.65 52.35,43 Q1.3
  Top 0.406: K2.1 48.48,40.48 49.5,41.5 Q1.3 D2.A
N$12
  Top 0.254: U3.8 64.35,48.95 64.1,48.7 64.1,48.3 63.9,48.1 Y1.3
N$13
  Top 0.305: U$3.2 30.8,67.7 30,68.5 30,72.25 30.4,72.65 D7.A 31,74.75 32.75,76.5 33.01,76.76 X1.7
N$14
  Top 0.813: D1.A 16.65,76.9 18,78.25 X1.10
N$15
  Top 0.305: Q1.1 47.95,42.45 R23.2
N$17
  Top 0.305: LED1.A R5.2
N$18
  Top 0.305: R22.2 LED4.A
N$19
  Top 0.305: U$4.1 38.17,69.77 R19.2 38.25,70.35 D8.C
N$20
  Top 0.305: U$4.2 35.55,67.7 35,68.25 35,72.25 35.4,72.65 D8.A 36,75 37,76 38.01,77.01 X1.6
N$23
  Top 0.305: R18.2 LED3.A
N$26
  Top 0.305: D9.C 43.25,70.35 R25.2 43.17,69.77 U$5.1
N$27
  Top 0.305: U$5.2 40.55,67.7 40,68.25 40,72.25 40.4,72.65 D9.A 41,74 41.5,74.5 42.99,75.99 X1.5
N$28  (via drill 0.25)
  Top 0.305: LED9.C v50,46.5 | v61.5,46.5 61.5,41.25 62.26,40.49 66.24,40.49
  Top 0.406: D5.A Q4.3 67.25,41.5 66.24,40.49 K1.1
  Bottom 0.305: v50,46.5 v61.5,46.5
N$30
  Top 0.305: R10.2 LED9.A
N$31
  Top 0.305: R24.2 LED8.A
N$32
  Top 0.305: C11.2 66.75,61.25 67.75,62.25 67.75,65 68.64,65.89 U5.4
N$33
  Top 0.305: R8.2 LED12.A
N$37
  Top 0.305: LED5.C 41.75,52.5 36.17,46.92 D3.A
  Top 0.406: K3.1 30.6,40.1 32,41.5 Q2.3 D3.A
N$39
  Top 0.305: Q4.1 65.7,42.45 R11.2
N$41
  Top 0.305: Q2.1 30.2,42.45 R27.2
N$43
  Top 0.305: R26.2 LED5.A
N$46
  Top 2.54: K1.C 72.24,21.18 68.02,16.97 68,4.37
  Bottom 2.54: K1.C 72.24,21.18 68,16.94 68,5.06 O.11
N$48
  Top 2.54: K1.NC 73.05,15.4 73.05,4.65
  Bottom 2.54: K1.NC 73.05,15.4 O.12
N$49
  Top 2.54: K1.NO 63.04,17.39 63.04,4.37
  Bottom 2.54: K1.NO 63.04,17.39 O.10
N$50
  Top 0.305: LED6.C 50,55.5 48,53.5 40.75,53.5 34.5,47.25 24.43,47.25 19.18,42 D4.A
  Top 0.406: K4.1 12.82,40.32 14,41.5 Q3.3 D4.A
N$51
  Top 0.305: Q3.1 15.25,44.9 R29.2
N$52
  Top 2.54: K2.C 54.48,22.94 52.98,21.44 53.03,4.42
  Bottom 2.54: K2.C 54.48,22.96 52.98,21.46 52.98,7.67 O.8
N$53
  Top 2.54: K2.NC 58.01,18.14 58.04,4.37
  Bottom 2.54: K2.NC 58.01,18.14 O.9
N$54
  Top 2.54: K2.NO 48.01,20.14 O.7
  Bottom 2.54: K2.NO 48.01,20.14 O.7
N$56
  Top 0.305: R28.2 LED6.A
N$57
  Top 2.54: K3.C 36.6,22.56 38.02,21.14 O.5 38,7.62
  Bottom 2.54: K3.C 36.6,22.56 38.02,21.14 O.5
N$58
  Top 2.54: K3.NC 43.03,20.19 O.6
  Bottom 2.54: K3.NC 43.03,20.19 43.03,7.7
N$59
  Top 2.54: K3.NO 33.05,18.17 33.05,4.27
  Bottom 2.54: K3.NO 33.02,18.19 O.4
N$62
  Top 2.54: K4.C 18.82,21.06 23.06,16.82 23.09,4.27 22.94,7.55
  Bottom 2.54: K4.C 18.82,21.06 23.04,16.84 23.04,7.7 O.2
N$63
  Top 2.54: K4.NC 28.02,17.44 28.02,4.24
  Bottom 2.54: K4.NC 27.99,17.47 O.3
N$64
  Top 2.54: K4.NO 17.98,15.48 17.98,4.47
  Bottom 2.54: K4.NO 17.98,15.48 O.1
OPT_INPUT_1
  Top 0.254: LED12.C 53,70.25 53.5,69.75 53.5,60.25 54.5,59.25 65.5,59.25 66.7,58.05 U3.32
  Top 0.305: LED12.C 50.5,70.25 46,65.75 30,65.75 28.17,63.92 U$17.4 28.17,59.57 R7.2
OPT_INPUT_2
  Top 0.254: LED1.C 52.75,67.25 53,67 53,60 54.25,58.75 62.75,58.75 63.5,58 63.5,55.25 64.2,54.55 U3.1
  Top 0.305: LED1.C 50.5,67.25 47.75,64.5 34.5,64.5 33.17,63.17 U$3.4 33.17,59.57 R4.2
OPT_INPUT_3
  Top 0.254: LED3.C 52.25,64.25 52.5,64 52.5,59.5 53.75,58.25 62.25,58.25 62.75,57.75 62.75,54.5 63.5,53.75 U3.2
  Top 0.305: LED3.C 50.5,64.25 49.5,63.25 39.25,63.25 38.17,62.17 U$4.4 38.17,59.57 R17.2
OPT_INPUT_4  (via drill 0.25)
  Top 0.254: U3.9 66.7,46.8 66.3,46.4 65.9,46.4 v65.3,47 | v51.5,59.7 LED8.C
  Top 0.305: LED8.C 43.22,61.25 U$5.4 43.17,59.57 R20.2
  Bottom 0.254: v65.3,47 65.2,47.1 64.1,47.1 v51.5,59.7
RELAY_1
  Top 0.254: U3.13 69.9,44.9 68.9,43.9 63.1,43.9 62.85,43.65 R11.1
RELAY_2  (via drill 0.25)
  Top 0.254: U3.12 69,47.36 v69,46 | v45.25,44.5 45.25,42.65 R23.1
  Bottom 0.254: v69,46 69,45.5 68.25,44.75 45.5,44.75 v45.25,44.5
RELAY_3  (via drill 0.25)
  Top 0.254: U3.11 68.3,46.3 v68,46 | v27.75,44.5 27.75,42.9 R27.1
  Bottom 0.254: v68,46 68,45.5 67.75,45.25 28.5,45.25 v27.75,44.5
RELAY_4  (via drill 0.25)
  Top 0.254: U3.10 67.5,46.6 67,46.1 v67,46 | v19.75,45 R29.1
  Bottom 0.254: v67,46 66.75,45.75 20.5,45.75 v19.75,45
RESET  (via drill 0.25)
  Top 0.254: C1.2 76.7,53.8 v76.2,53.3
  Top 0.305: U3.29 69.1,57.3 69.5,57.7 72.85,57.7 75.7,54.85 C1.2 R30.2
  Bottom 0.254: J2.5 77.82,41.28 75.55,43.55 73.7,43.55 72.4,44.85 72.4,47.5 76.2,51.3 v76.2,53.3
RS_TX  (via drill 0.25)
  Top 0.254: v70.25,48.75 70.41,48.75 70.7,48.46 U3.14 | v62.5,63.5 62.5,65.54 U2.1
  Bottom 0.254: v70.25,48.75 70.25,55.5 62.5,63.25 v62.5,63.5
RXI
  Top 0.305: U3.30 68.3,57.55 69.5,58.75 71.75,58.75 73.5,60.5 73.5,66.75 71.83,68.42 U5.2
SCK
  Top 0.305: U3.17 76.3,48.95 76.75,48.5 76.75,45 77.93,43.82 J2.3
TXO
  Top 0.305: U3.31 67.5,58 69,59.5 71.5,59.5 72.75,60.75 72.75,66 71.59,67.16 U5.3
USBVCC
  Top 0.508: Q5.3 80.4,62.35 79.85,62.9 C5.2 C15.+ 80.75,67 81.25,67.5 81.25,68.75 82,69.5 F3.2
VIN  (via drill 0.25)
  Top 0.406: v28.5,74.5 R9.1 | v33.5,74.5 R16.1 | v38.5,74.5 R19.1 | v43.5,74.5 R25.1
  Top 0.813: U1.3 9.1,72.45 D1.C 13.4,72.6 14,72 C7.+ v20,72
  Bottom 0.406: v20,72 22.5,74.5 v28.5,74.5 v33.5,74.5 v38.5,74.5 v43.5,74.5
  Bottom 0.813: J17.4 16.87,49.12 20,52.25 v20,72
VUSB
  Top 0.508: J3.VBUS 72.75,73.75 74.5,72 C13.2 79.6,69.75 F3.1
(copper drawn outside any net)
  shapes: Top area x1

### Text on the board
Top: AK
tPlace: 12V | GND | I1 | I2 | I3 | I4 | GND | A | B | GND | I1 | I2 | I3 | I4 | R1 | PWR | R2 | Mini_PLC | R3 | 12V | R4 | 5V | R1 | R2 | R3 | R4 | R1-NO | R1-CO | R1-NC | R2-NO | R2-CO | R2-NC | R3-NO | R3-CO | R3-NC | R4-NO | R4-CO | R4-NC
214bmp: D:/SmartProjects/Snc/a4_bn_logo2.bmp